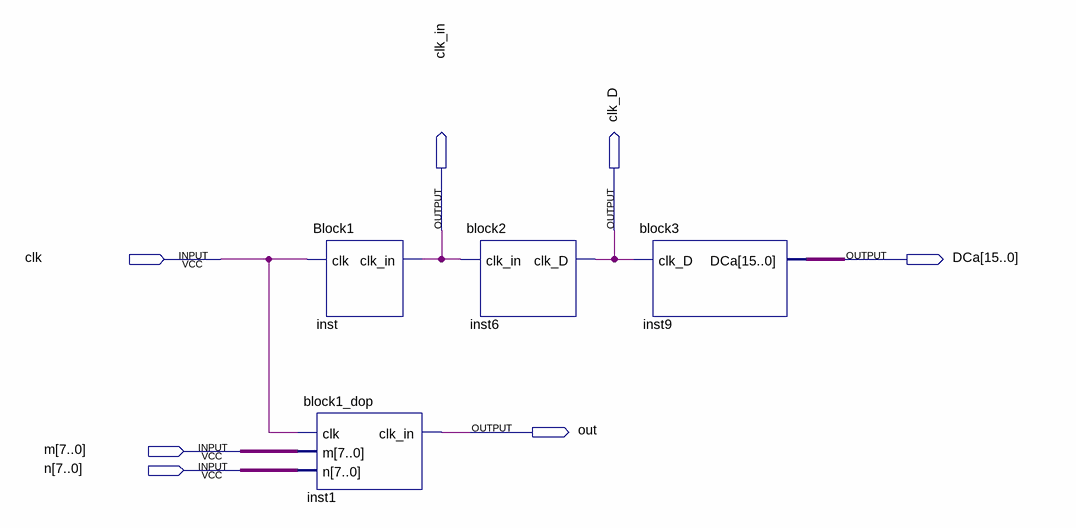
[diagram p0: schematic sheet]
// Quartus schematic main.bdf as structural Verilog: 4 symbols, 7 pins
module main (
  input  clk,
  input  [7:0] m,
  input  [7:0] n,
  output clk_in,
  output clk_D,
  output [15:0] DCa,
  output out
);

  Block1 inst (.clk(clk), .clk_in(clk_in));
  block1_dop inst1 (.clk(clk), .m(m), .n(n), .clk_in(out));
  block2 inst6 (.clk_in(clk_in), .clk_D(clk_D));
  block3 inst9 (.clk_D(clk_D), .DCa(DCa));
endmodule
